# EAGLE design alarme (EAGLE 4.11)
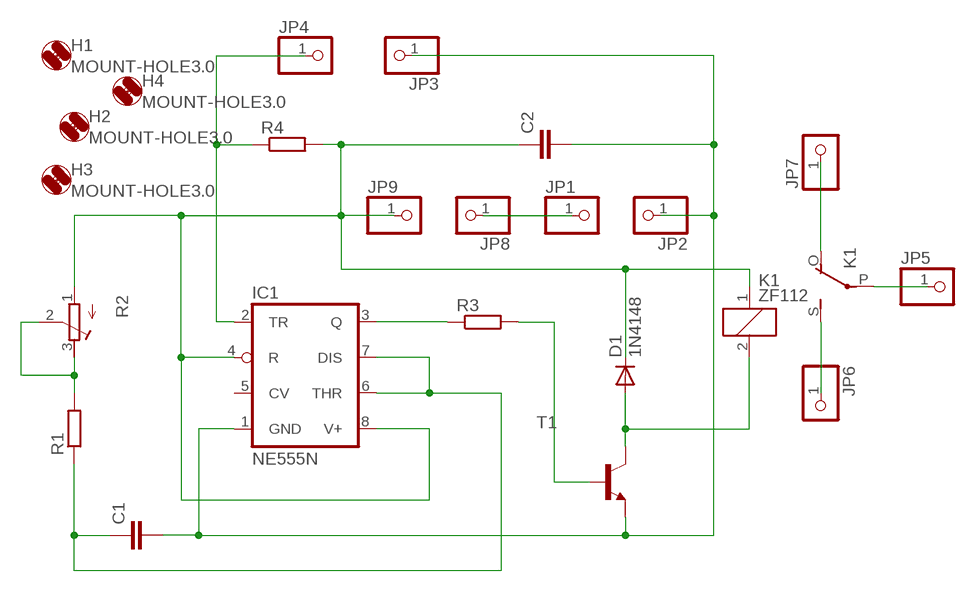
[diagram p0: schematic, sheet 1]

## Parts
C1  C-EU102-043X133  [C102-043X133]
C2  C-EU102-043X133  [C102-043X133]
D1  1N4148  [DO35-10]
H1  MOUNT-HOLE3.0  [3,0]
H2  MOUNT-HOLE3.0  [3,0]
H3  MOUNT-HOLE3.0  [3,0]
H4  MOUNT-HOLE3.0  [3,0]
IC1  NE555N  [DIL08]
JP1  PINHD-1X1  [1X01]
JP2  PINHD-1X1  [1X01]
JP3  PINHD-1X1  [1X01]
JP4  PINHD-1X1  [1X01]
JP5  PINHD-1X1  [1X01]
JP6  PINHD-1X1  [1X01]
JP7  PINHD-1X1  [1X01]
JP8  PINHD-1X1  [1X01]
JP9  PINHD-1X1  [1X01]
K1  ZF112  [ZF112]
R1  R-EU_0207/10  [0207/10]
R2  R-TRIMM3339P  [RTRIM3339P]
R3  R-EU_0207/10  [0207/10]
R4  R-EU_0207/10  [0207/10]
T1  BC548A-NPN-TO92-EBC  [TO92-EBC]

## Nets
N$1: C2.1 D1.C IC1.4(R) IC1.8(V+) JP9.1 K1.1 R2.1(E) R4.2
N$2: C1.1 IC1.6(THR) IC1.7(DIS) R1.1
N$3: C1.2 C2.2 IC1.1(GND) JP2.1 JP3.1 T1.E
N$4: R1.2 R2.2(S) R2.3(A)
N$5: IC1.3(Q) R3.1
N$6: R3.2 T1.B
N$7: JP6.1 K1.S(2:S)
N$8: IC1.2(TR) JP4.1 R4.1
N$39: D1.A K1.2 T1.C
N$40: JP5.1 K1.P(2:P)
N$46: JP7.1 K1.O(2:O)
N$48: JP1.1 JP8.1
Unconnected: IC1.5(CV)

## Library data of the parts
C1 C2 = rcl:C-EU: CAPACITOR, European symbol
D1 = diode:1N4148: DIODE high speed (Philips)
H1-H4 = holes:MOUNT-HOLE: MOUNTING HOLE with drill center marker
IC1 = linear:*555: TIMER
JP1-JP9 = pinhead:PINHD-1X1: PIN HEADER
K1 = relay:ZF112: RELAY 1 x switch
R1 R3 R4 = rcl:R-EU_: RESISTOR, European symbol
R2 = rcl:R-TRIMM: Trimm resistor
T1 = transistor:*-NPN-: NPN Transistror

## Board
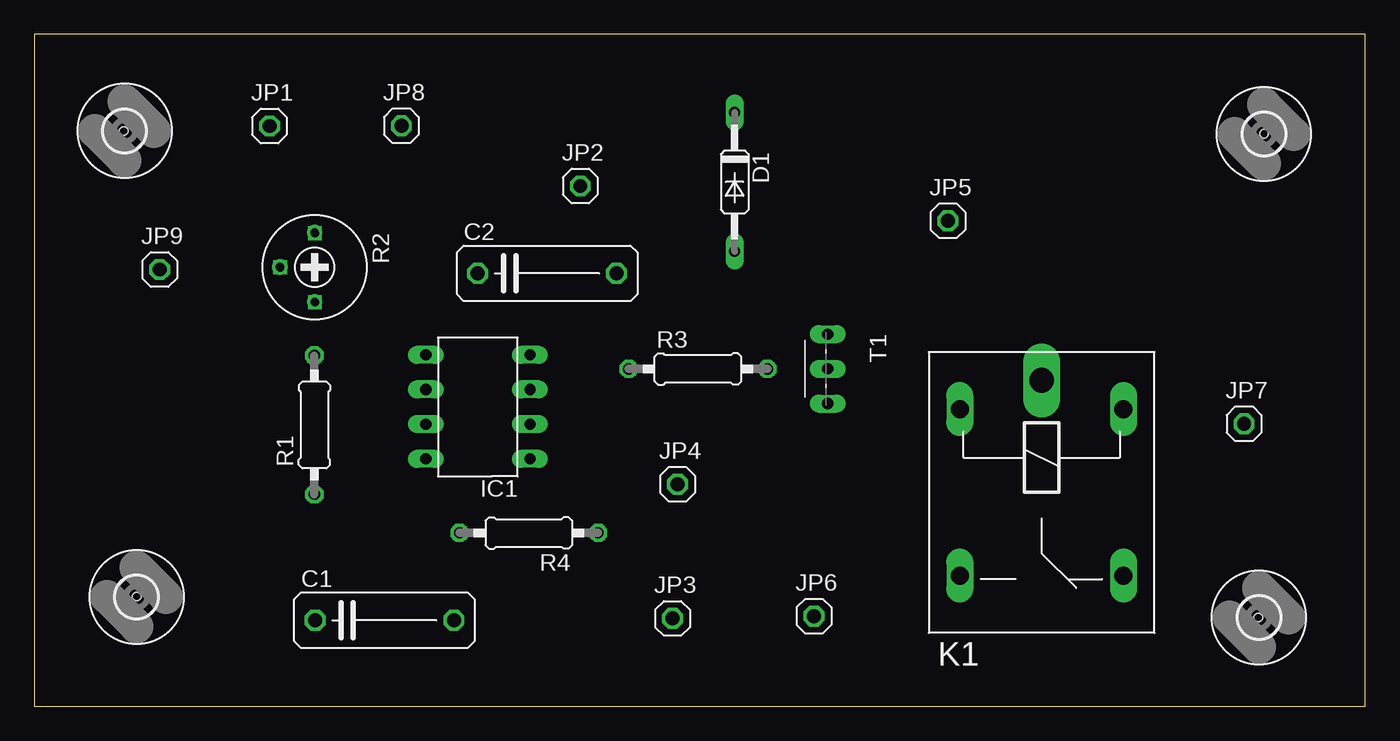
[diagram p1: board, top side]
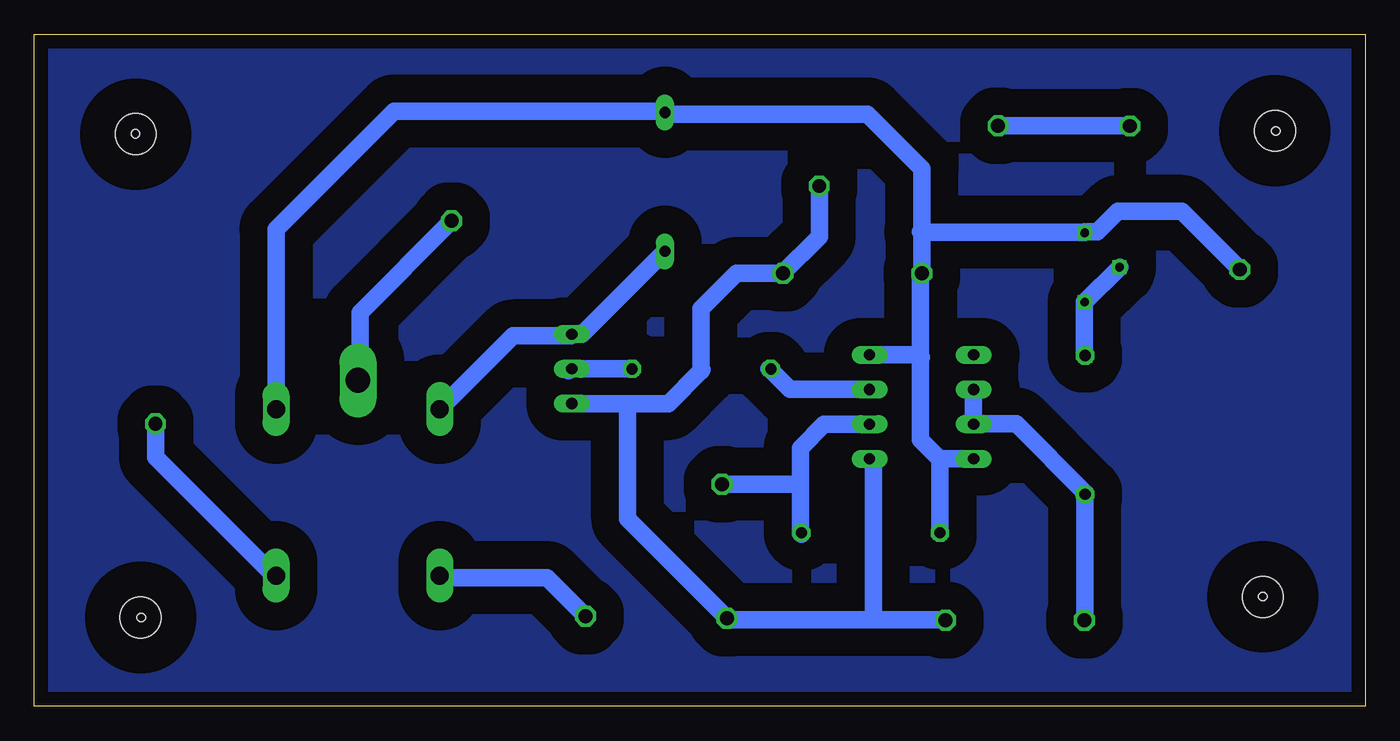
[diagram p2: board, bottom side, seen from below]

Size 97.46 x 49.2 mm. Coordinates in mm from the lower left corner, seen from the top.
Outline: 0,0 97.46,0 97.46,49.2 0,49.2 0,0
Copper layers 16: Bottom 0.035mm
Design rules "default": minimum track width 10mil, minimum drill 24mil, track to track 80mil, track to pad 80mil, pad to pad 80mil, via to via 80mil, smd to smd 80mil, copper to edge 40mil, drill to drill 8mil, minimum pad ring 10mil, minimum via ring 8mil, stop-mask expansion 4mil, vias tented up to drill 0mil, thermal gap 10mil
Holes 0.61 mm at 89.63,6.5 90.05,41.91 6.56,42.12 7.51,8.04

### Footprints (pad centres in the part's own frame; a part is rotated, then mirrored left to right if it is on the bottom)
C102-043X133 = drill 1.016 octagon: 1 -5.08,0; 2 5.08,0
DO35-10 = drill 0.813 long: A 5.08,0; C -5.08,0
3,0 = hole 3: 0,0
DIL08 = drill 0.813 long: 1 -3.81,-3.81; 2 -1.27,-3.81; 3 1.27,-3.81; 4 3.81,-3.81; 5 3.81,3.81; 6 1.27,3.81; 7 -1.27,3.81; 8 -3.81,3.81
1X01 = drill 1.016 octagon: 1 0,0
ZF112 = drill 1.321 long: 1 -6.096,5.994; 2 -6.096,-5.994; O 6.096,5.994; S 6.096,-5.994 | drill 1.803 long: P -8.204,0
0207/10 = drill 0.813 octagon: 1 -5.08,0; 2 5.08,0
RTRIM3339P = drill 0.61 round: 1 -2.54,0; 2 0,-2.54; 3 2.54,0
TO92-EBC = drill 0.813 long: B 0,-1.27; C -2.54,-1.27; E 2.54,-1.27

### Placement (x,y rotation side)
C1  25.65,6.31 0 top
C2  37.55,31.7 0 top
D1  51.28,38.39 270 top
H1  89.66,6.51 0 top
H2  6.62,42.13 0 top
H3  7.51,8.02 0 top
H4  90.02,41.89 0 top
IC1  32.48,21.93 90 top
JP1  17.23,42.48 0 top
JP2  39.98,38.09 0 top
JP3  46.74,6.45 0 top
JP4  47.1,16.26 0 top
JP5  66.89,35.54 0 top
JP6  57.09,6.61 0 top
JP7  88.57,20.68 0 top
JP8  26.89,42.49 0 top
JP9  9.18,31.98 0 top
K1  73.76,15.66 270 top
R1  20.52,20.6 90 top
R2  20.53,32.15 270 top
R3  48.6,24.7 0 top
R4  36.22,12.7 180 top
T1  59.36,24.71 270 top

### Tracks (layer width: path | path; a pad name or v marks a point on that pad's centre or on a via)
N$1
  Bottom 1.27: 31.18,18.12 IC1.8 | 31.18,18.12 32.58,19.52 32.58,25.55 | 32.58,25.55 32.58,31.75 32.49,31.84 32.47,31.82 C2.1 32.45,31.71 32.45,34.72 | 32.58,25.55 32.49,25.55 32.68,25.74 IC1.4 | 31.18,18.12 31.18,18.04 31.18,18.03 31.13,17.99 R4.2 | K1.1 79.75,34.92 71.11,43.56 51.56,43.56 51.31,43.31 51.28,43.34 | 51.28,43.34 D1.C | 51.28,43.34 36.44,43.34 32.45,39.35 32.45,34.72 | 32.45,34.72 32.57,34.72 32.54,34.69 R2.1 20.53,34.72 19.61,34.72 18.1,36.23 13.43,36.23 JP9.1
N$2
  Bottom 1.27: 20.58,15.46 R1.1 | IC1.6 28.68,23.19 28.68,20.68 | 28.68,20.68 28.68,20.67 IC1.7 | 20.58,15.46 20.61,15.5 | R1.1 20.46,15.58 25.56,20.68 28.68,20.68 | R1.1 | 20.58,15.46 20.55,15.43 20.55,6.33 C1.1
N$3
  Bottom 1.27: 54.01,22.17 51.02,22.17 48.66,24.54 | 54.01,22.17 T1.E | 48.66,24.54 48.55,24.65 | 54.01,22.17 54.01,13.72 JP3.1 46.81,6.37 46.81,6.35 36.01,6.35 | C1.2 30.78,6.35 36.01,6.35 | IC1.1 36.01,17.83 36.01,6.35 | 42.71,31.7 46.05,31.7 48.65,29.1 48.65,24.53 48.66,24.54 | 42.71,31.7 C2.2 | 48.66,24.54 | 42.71,31.7 42.71,31.66 39.98,34.39 JP2.1
N$4
  Bottom 1.27: R2.3 20.58,29.61 20.58,29.53 | R1.2 20.58,25.68 20.58,29.53 | R2.2 20.58,29.57 20.58,29.53
N$5  (via drill 0.61)
  Bottom 1.27: 43.64,24.7 43.65,24.71 | 43.64,24.7 v43.54,24.7 R3.1 | IC1.3 42.13,23.2 43.64,24.7
N$6  (via drill 0.61)
  Bottom 1.27: 58.2,24.7 58.19,24.71 T1.B | R3.2 v53.69,24.7 v58.09,24.7 58.2,24.7 | 58.2,24.7 58.34,24.56
N$7
  Bottom 1.27: K1.S 67.75,9.44 59.92,9.44 JP6.1
N$8
  Bottom 1.27: IC1.2 39.62,20.66 41.36,18.91 41.36,16.19 | 41.3,12.61 41.28,12.59 | R4.1 41.3,12.61 | 41.36,16.19 41.36,12.68 41.3,12.61 | 41.36,16.19 41.45,16.19 41.53,16.26 JP4.1
N$9
  pour Bottom: 0.63,0.47 0.63,48.7 96.77,48.7 96.77,0.47
N$10  (via drill 0.61)
  other vias: 9.26,31.96
N$11  (via drill 0.61)
  other vias: 51.27,43.47
N$12  (via drill 0.61)
  other vias: 66.91,35.56
N$13  (via drill 0.61)
  other vias: 39.98,38.07
N$14  (via drill 0.61)
  other vias: 42.66,31.69
N$15  (via drill 0.61)
  other vias: 51.36,33.32
N$16  (via drill 0.61)
  other vias: 57.12,6.56
N$17  (via drill 0.61)
  other vias: 58.13,27.25
N$18  (via drill 0.61)
  other vias: 20.55,34.64
N$19  (via drill 0.61)
  other vias: 32.51,31.69
N$20  (via drill 0.61)
  other vias: 36.29,25.71
N$21  (via drill 0.61)
  other vias: 28.69,25.75
N$22  (via drill 0.61)
  other vias: 20.55,29.58
N$23  (via drill 0.61)
  other vias: 20.51,25.67
N$24  (via drill 0.61)
  other vias: 28.69,23.16
N$25  (via drill 0.61)
  other vias: 36.29,23.2
N$26  (via drill 0.61)
  other vias: 36.29,20.61
N$27  (via drill 0.61)
  other vias: 36.33,18.06
N$28  (via drill 0.61)
  other vias: 28.69,18.1
N$29  (via drill 0.61)
  other vias: 28.69,20.61
N$30  (via drill 0.61)
  other vias: 31.15,12.69
N$31  (via drill 0.61)
  other vias: 20.51,15.51
N$32  (via drill 0.61)
  other vias: 41.3,12.69
N$33  (via drill 0.61)
  other vias: 47.1,16.26
N$34  (via drill 0.61)
  other vias: 58.08,22.15
N$35  (via drill 0.61)
  other vias: 46.75,6.45
N$36  (via drill 0.61)
  other vias: 30.75,6.32
N$37  (via drill 0.61)
  other vias: 20.55,6.32
N$38  (via drill 0.61)
  other vias: 18.01,32.13
N$39
  Bottom 1.27: K1.2 62.4,27.12 58.16,27.12 58.16,27.18 T1.C | T1.C 58.16,27.24 | D1.A 57.35,27.24 T1.C
N$40
  Bottom 1.27: K1.P 73.64,23.76 73.6,23.76 73.6,28.82 JP5.1
N$41  (via drill 0.61)
  other vias: 67.81,9.57
N$42  (via drill 0.61)
  other vias: 67.81,21.74
N$43  (via drill 0.61)
  other vias: 79.78,21.69
N$44  (via drill 0.61)
  other vias: 73.74,23.86
N$45  (via drill 0.61)
  other vias: 79.78,9.63
N$46
  Bottom 1.27: K1.O 79.75,9.51 79.79,9.47 88.57,18.25 JP7.1
N$47  (via drill 0.61)
  other vias: 88.62,20.64
N$48
  Bottom 1.27: 26.89,42.37 26.9,42.36 | 26.89,42.37 JP8.1 | JP1.1 26.78,42.48 26.89,42.37
N$49  (via drill 0.61)
  other vias: 17.2,42.43
N$50  (via drill 0.61)
  other vias: 26.94,42.49